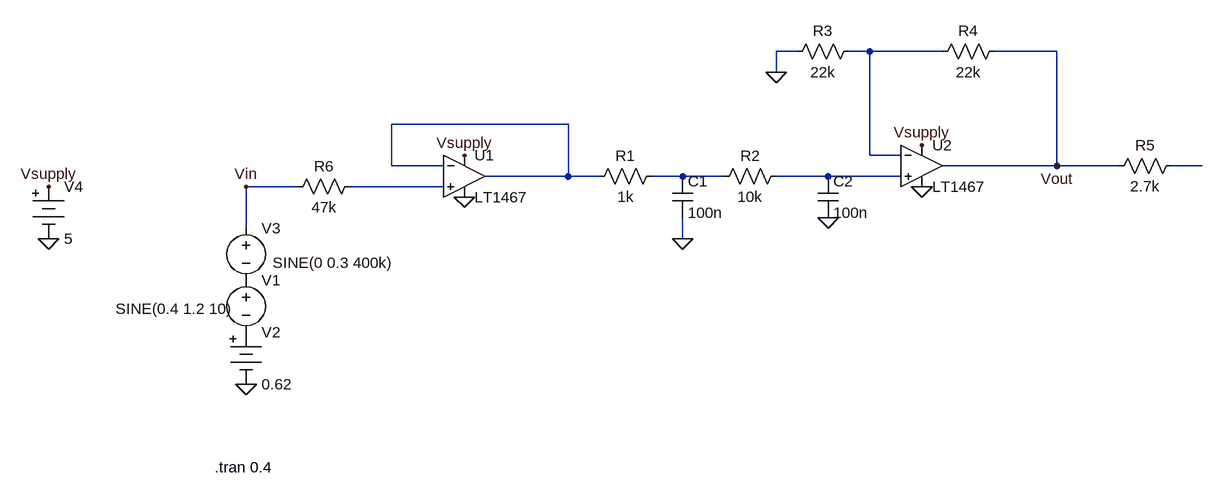
[diagram p0: schematic analogcircuit.asc]
analogcircuit.asc, the LTspice schematic file:
Version 4
SHEET 1 1684 680
WIRE 1056 -96 1024 -96
WIRE 1168 -96 1136 -96
WIRE 1280 -96 1168 -96
WIRE 1456 -96 1360 -96
WIRE 1024 -64 1024 -96
WIRE 704 16 432 16
WIRE 1168 64 1168 -96
WIRE 1216 64 1168 64
WIRE 432 80 432 16
WIRE 512 80 432 80
WIRE 1456 80 1456 -96
WIRE 1456 80 1280 80
WIRE 1552 80 1456 80
WIRE 1680 80 1632 80
WIRE 704 96 704 16
WIRE 704 96 576 96
WIRE 752 96 704 96
WIRE 880 96 832 96
WIRE 944 96 880 96
WIRE 1104 96 1024 96
WIRE 1216 96 1104 96
WIRE 288 112 208 112
WIRE 512 112 368 112
WIRE 208 176 208 112
WIRE 880 192 880 160
FLAG 208 416 0
FLAG -96 192 0
FLAG -96 112 Vsupply
FLAG 880 192 0
FLAG 1104 160 0
FLAG 544 64 Vsupply
FLAG 1248 48 Vsupply
FLAG 1024 -64 0
FLAG 1248 112 0
FLAG 544 128 0
FLAG 208 112 Vin
FLAG 1456 80 Vout
SYMBOL voltage 208 240 R0
WINDOW 3 -201 60 Left 2
SYMATTR Value SINE(0.4 1.2 10)
SYMATTR InstName V1
SYMBOL Misc/battery 208 320 R0
SYMATTR InstName V2
SYMATTR Value 0.62
SYMBOL Voltage 208 160 R0
WINDOW 3 41 69 Left 2
SYMATTR Value SINE(0 0.3 400k)
SYMATTR InstName V3
SYMBOL OpAmps/LT1467 544 32 R0
SYMATTR InstName U1
SYMBOL Misc/battery -96 96 R0
SYMATTR InstName V4
SYMATTR Value 5
SYMBOL Res 848 80 R90
WINDOW 0 0 56 VBottom 2
WINDOW 3 32 56 VTop 2
SYMATTR InstName R1
SYMATTR Value 1k
SYMBOL Res 1040 80 R90
WINDOW 0 0 56 VBottom 2
WINDOW 3 32 56 VTop 2
SYMATTR InstName R2
SYMATTR Value 10k
SYMBOL Cap 864 96 R0
SYMATTR InstName C1
SYMATTR Value 100n
SYMBOL Cap 1088 96 R0
SYMATTR InstName C2
SYMATTR Value 100n
SYMBOL OpAmps/LT1467 1248 16 R0
SYMATTR InstName U2
SYMBOL Res 1152 -112 R90
WINDOW 0 0 56 VBottom 2
WINDOW 3 32 56 VTop 2
SYMATTR InstName R3
SYMATTR Value 22k
SYMBOL Res 1376 -112 R90
WINDOW 0 0 56 VBottom 2
WINDOW 3 32 56 VTop 2
SYMATTR InstName R4
SYMATTR Value 22k
SYMBOL Res 1648 64 R90
WINDOW 0 0 56 VBottom 2
WINDOW 3 32 56 VTop 2
SYMATTR InstName R5
SYMATTR Value 2.7k
SYMBOL Res 384 96 R90
WINDOW 0 0 56 VBottom 2
WINDOW 3 32 56 VTop 2
SYMATTR InstName R6
SYMATTR Value 47k
TEXT 160 544 Left 2 !.tran 0.4

The netlist it stands for:
* analogcircuit.asc
V1 P001 P002 SINE(0.4 1.2 10)
V2 P002 0 0.62
V3 Vin P001 SINE(0 0.3 400k)
XU1 N006 N002 Vsupply 0 N002 LT1467  ; pins In+ In- V+ V- OUT
V4 Vsupply 0 5
R1 N004 N002 1k
R2 N005 N004 10k
C1 N004 0 100n
C2 N005 0 100n
XU2 N005 N001 Vsupply 0 Vout LT1467  ; pins In+ In- V+ V- OUT
R3 N001 0 22k
R4 Vout N001 22k
R5 N003 Vout 2.7k
R6 N006 Vin 47k
.tran 0.4
.backanno
.end